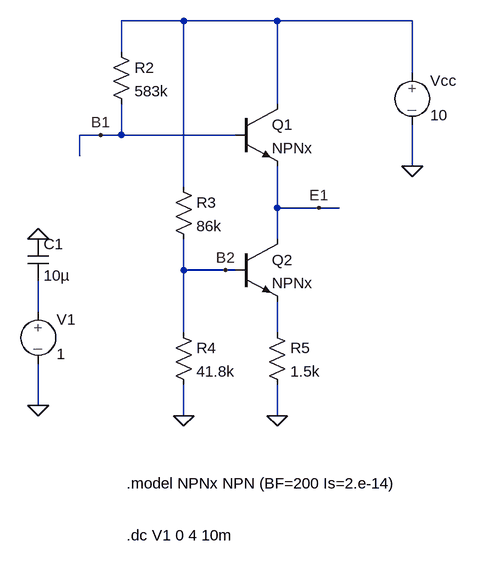
[diagram p0: schematic NPN_standard.asc]
NPN_standard.asc, the LTspice schematic file:
Version 4
SHEET 1 1056 680
WIRE 624 -224 528 -224
WIRE 768 -224 624 -224
WIRE 976 -224 768 -224
WIRE 528 -176 528 -224
WIRE 976 -144 976 -224
WIRE 768 -96 768 -224
WIRE 496 -48 464 -48
WIRE 528 -48 528 -96
WIRE 528 -48 496 -48
WIRE 704 -48 528 -48
WIRE 464 -16 464 -48
WIRE 976 0 976 -64
WIRE 624 32 624 -224
WIRE 768 64 768 0
WIRE 832 64 768 64
WIRE 864 64 832 64
WIRE 768 112 768 64
WIRE 624 160 624 112
WIRE 688 160 624 160
WIRE 704 160 688 160
WIRE 400 224 400 176
WIRE 624 256 624 160
WIRE 768 256 768 208
WIRE 400 368 400 304
WIRE 624 384 624 336
WIRE 768 384 768 336
FLAG 624 384 0
FLAG 768 384 0
FLAG 976 0 0
FLAG 496 -48 B1
FLAG 832 64 E1
FLAG 400 368 0
FLAG 688 160 B2
FLAG 400 112 0
SYMBOL EIT_Semiconductors\\npn 704 -96 R0
SYMATTR InstName Q1
SYMATTR Value NPNx
SYMBOL EIT_Semiconductors\\npn 704 112 R0
SYMATTR InstName Q2
SYMATTR Value NPNx
SYMBOL res 752 240 R0
SYMATTR InstName R5
SYMATTR Value 1.5k
SYMBOL res 608 16 R0
SYMATTR InstName R3
SYMATTR Value 86k
SYMBOL res 608 240 R0
SYMATTR InstName R4
SYMATTR Value 41.8k
SYMBOL res 512 -192 R0
SYMATTR InstName R2
SYMATTR Value 583k
SYMBOL source-V 976 -160 R0
WINDOW 123 0 0 Left 0
WINDOW 39 0 0 Left 0
SYMATTR InstName Vcc
SYMATTR Value 10
SYMBOL source-V 400 208 R0
WINDOW 123 0 0 Left 0
WINDOW 39 0 0 Left 0
SYMATTR InstName V1
SYMATTR Value 1
SYMBOL cap 384 112 R0
SYMATTR InstName C1
SYMATTR Value 10µ
TEXT 536 488 Left 0 !.model NPNx NPN (BF=200 Is=2.e-14)
TEXT 536 568 Left 0 !.dc V1 0 4 10m

The netlist it stands for:
* NPN_standard.asc
Q1 N001 B1 E1 0 NPNx
Q2 E1 B2 N003 0 NPNx
R5 N003 0 1.5k
R3 N001 B2 86k
R4 B2 0 41.8k
R2 N001 B1 583k
Vcc N001 0 10
V1 N002 0 1
C1 0 N002 10µ
.model NPN NPN
.model PNP PNP
.lib standard.bjt
.model NPNx NPN (BF=200 Is=2.e-14)
.dc V1 0 4 10m
.backanno
.end